# EAGLE design Voltage Regulator (EAGLE 7.6.0)
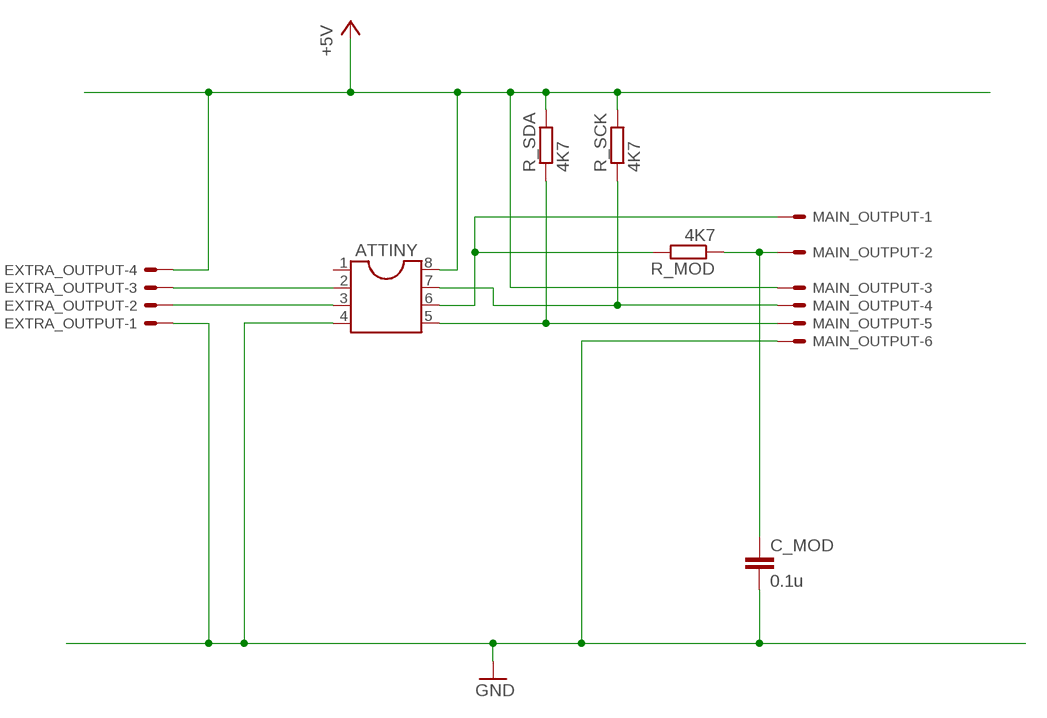
[diagram p0: schematic, sheet 1]

## Parts
ATTINY  DIL8  [DIL08]
C_MOD  0.1u  C-EUC1206  [C1206]
EXTRA_OUTPUT  KK-156-4  [KK-156-4]
MAIN_OUTPUT  KK-156-6  [KK-156-6]
R_MOD  4K7  R-EU_M0805  [M0805]
R_SCK  4K7  R-EU_M0805  [M0805]
R_SDA  4K7  R-EU_M0805  [M0805]

## Nets
+5V: ATTINY.8 EXTRA_OUTPUT.4 MAIN_OUTPUT.3 R_SCK.2 R_SDA.2
GND: ATTINY.4 C_MOD.2 EXTRA_OUTPUT.1 MAIN_OUTPUT.6
N$3: ATTINY.2 EXTRA_OUTPUT.3
N$5: ATTINY.3 EXTRA_OUTPUT.2
SCK: ATTINY.7 MAIN_OUTPUT.4 R_SCK.1
SDA: ATTINY.5 MAIN_OUTPUT.5 R_SDA.1
V_ANG: C_MOD.1 MAIN_OUTPUT.2 R_MOD.1
V_PWM: ATTINY.6 MAIN_OUTPUT.1 R_MOD.2
Unconnected: ATTINY.1

## Library data of the parts
ATTINY = ic-package:DIL8: Dual In Line / Socket
C_MOD = rcl:C-EU: CAPACITOR, European symbol
EXTRA_OUTPUT = con-molex:KK-156-4: KK 156 HEADER Source: http://www.molex.com/pdm_docs/sd/026604100_sd.pdf; OC_FARNELL: unknown; OC_NEWARK: unknown
MAIN_OUTPUT = con-molex:KK-156-6: KK 156 HEADER Source: http://www.molex.com/pdm_docs/sd/026604100_sd.pdf; OC_FARNELL: unknown; OC_NEWARK: unknown
R_MOD R_SCK R_SDA = rcl:R-EU_: RESISTOR, European symbol

## Board
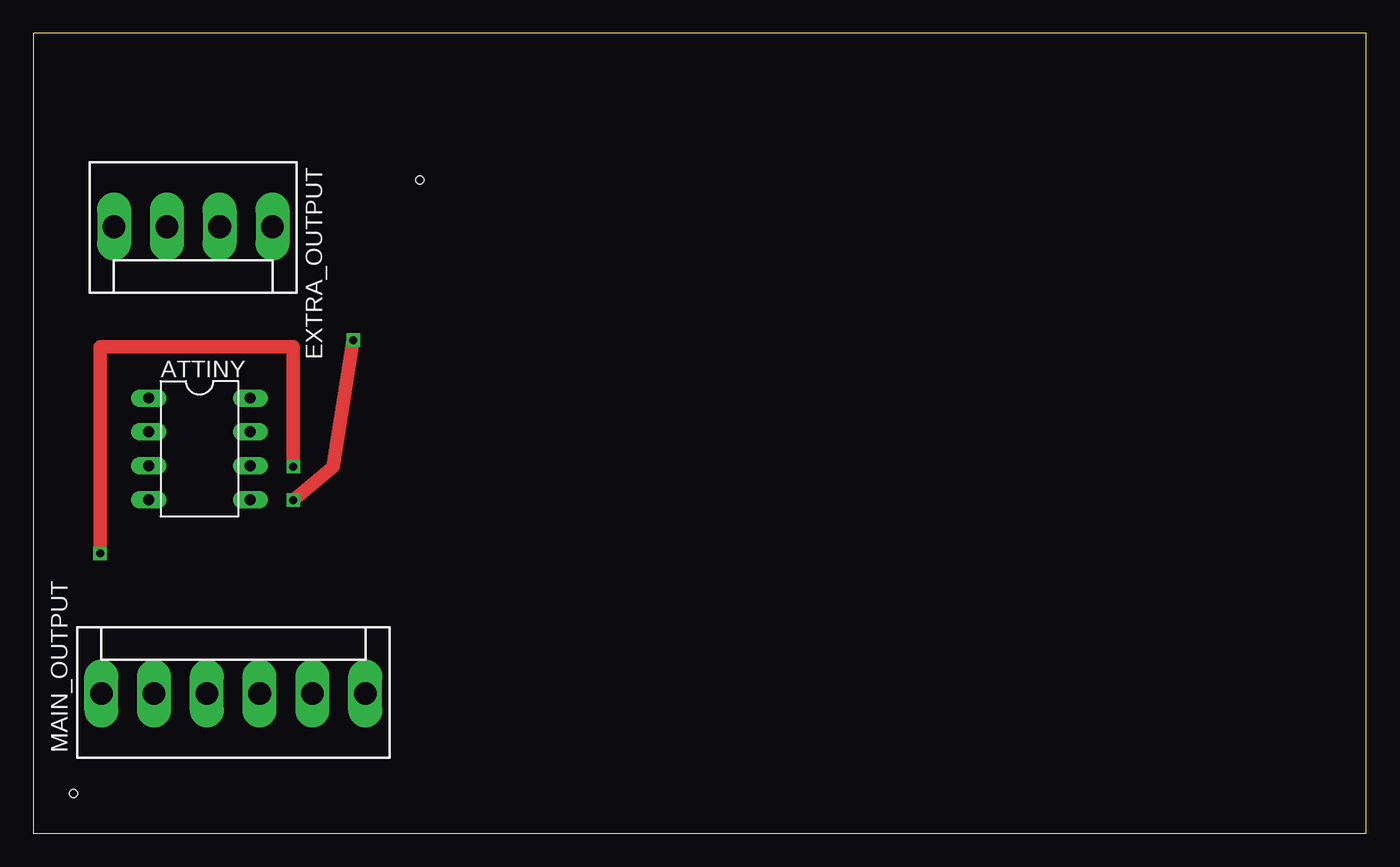
[diagram p1: board, top side]
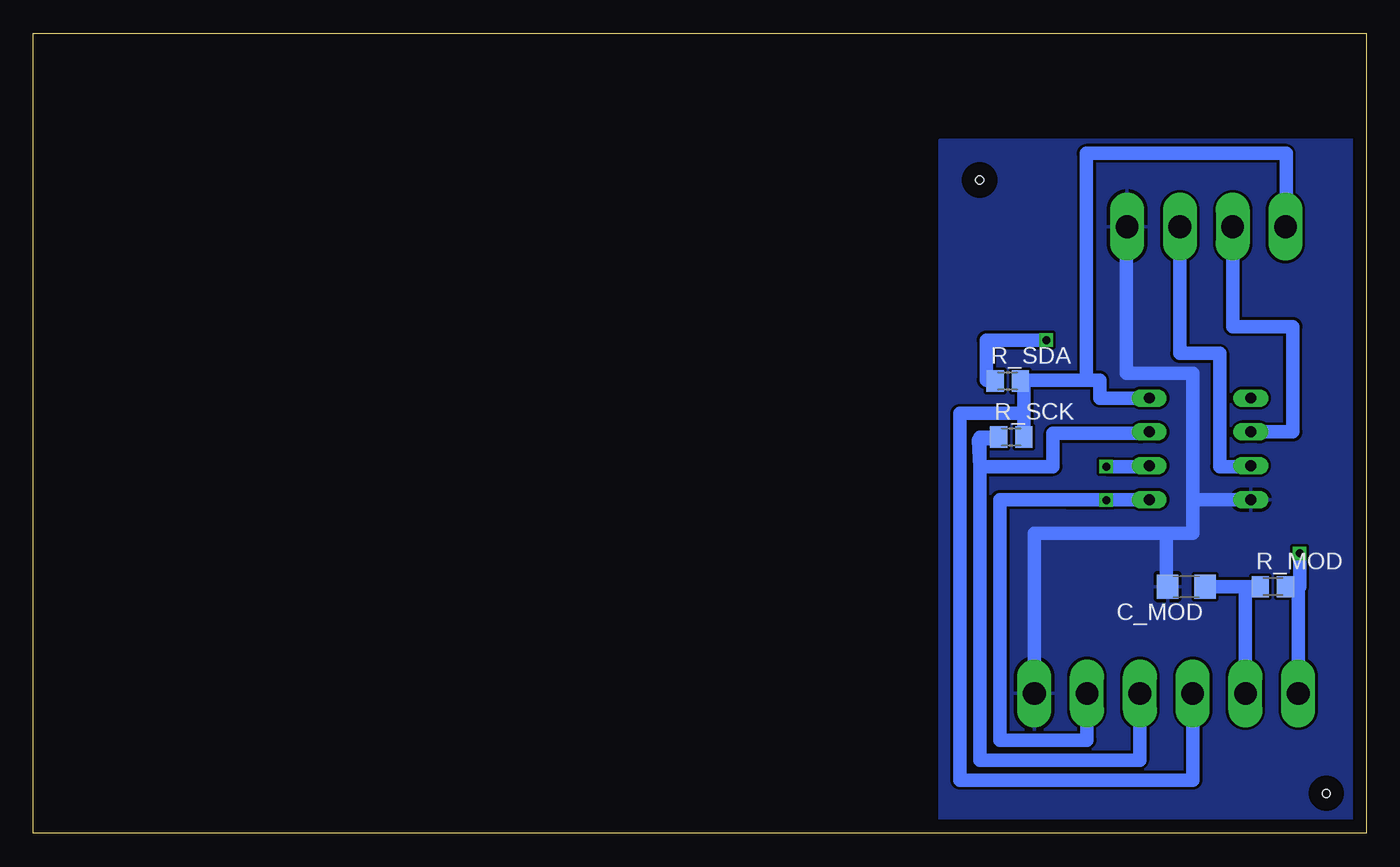
[diagram p2: board, bottom side, seen from below]

Size 100 x 60 mm. Coordinates in mm from the lower left corner, seen from the top.
Outline: 0,0 100,0 100,60 0,60 0,0
Copper layers (1*16): Top 0.035mm / dielectric 1.5mm / Bottom 0.035mm
Design rules "default *": minimum track width 10mil, minimum drill 24mil, track to track 8mil, track to pad 8mil, pad to pad 8mil, via to via 8mil, smd to smd 8mil, copper to edge 40mil, drill to drill 8mil, minimum pad ring 10mil, minimum via ring 8mil, stop-mask expansion 4mil, vias tented up to drill 0mil, thermal gap 10mil
Holes 0.6 mm at 3,3 29,49

### Footprints (pad centres in the part's own frame; a part is rotated, then mirrored left to right if it is on the bottom)
DIL08 = drill 0.813 long: 1 -3.81,-3.81; 2 -1.27,-3.81; 3 1.27,-3.81; 4 3.81,-3.81; 5 3.81,3.81; 6 1.27,3.81; 7 -1.27,3.81; 8 -3.81,3.81
C1206 = smd 1.6 x 1.8: 1 -1.4,0; 2 1.4,0
KK-156-4 = drill 1.7 pad 2.184 long: 1 -5.94,0; 2 -1.98,0; 3 1.98,0; 4 5.94,0
KK-156-6 = drill 1.7 pad 2.184 long: 1 -9.9,0; 2 -5.94,0; 3 -1.98,0; 4 1.98,0; 5 5.94,0; 6 9.9,0
M0805 = smd 1.3 x 1.6: 1 -0.95,0; 2 0.95,0

### Placement (x,y rotation side)
ATTINY  12.47,28.84 270 top
C_MOD  13.5,18.5 180 bottom
EXTRA_OUTPUT  12,45.5 180 top
MAIN_OUTPUT  15,10.5 0 top
R_MOD  7,18.5 0 bottom
R_SCK  26.63,29.72 0 bottom
R_SDA  26.9,33.92 0 bottom

### Tracks (layer width: path | path; a pad name or v marks a point on that pad's centre or on a via)
+5V
  Bottom 1.016: MAIN_OUTPUT.3 13,9 13,4 30.5,4 30.5,31.5 25.68,31.5 | ATTINY.8 20,32.65 20,34 21,34 | 21,34 25.45,34 R_SDA.2 25.68,33.92 25.68,31.5 | EXTRA_OUTPUT.4 6,45.5 6,51 21,51 21,34 | 25.68,31.5 R_SCK.2
GND
  Bottom 1.016: ATTINY.4 13,25.03 | 13,25.03 13,22.5 15,22.5 | 15,22.5 24.9,22.5 MAIN_OUTPUT.6 | EXTRA_OUTPUT.1 18,45.5 18,34.5 13,34.5 13,25.03 | C_MOD.2 15,18.5 15,22.5
  pour Bottom: 0,52 32,52 32,0 0,0
N$3
  Bottom 1.016: ATTINY.2 5.5,30.11 5.5,38 10.02,38 EXTRA_OUTPUT.3
N$5
  Bottom 1.016: EXTRA_OUTPUT.2 14,45.5 14,36 11,36 11,27.5 8.66,27.5 ATTINY.3
SCK
  Bottom 1.016: MAIN_OUTPUT.4 17,9 17,5.5 29,5.5 29,27.5 | 29,27.5 29.08,29.5 R_SCK.1 29,29.72 29,27.5 | ATTINY.7 16.28,30 23.5,30 23.5,27.5 29,27.5
SDA  (via drill 0.6)
  Top 1.016: v19.5,25 22.5,27.5 v24,37
  Bottom 1.016: MAIN_OUTPUT.5 20.94,7 27.5,7 27.5,25.03 ATTINY.5 22.5,25.03 v19.5,25 | v24,37 28.5,37 28.5,34 27.85,34 R_SDA.1
V_ANG
  Bottom 1.016: R_MOD.1 9.06,18.5 | 9.06,18.5 MAIN_OUTPUT.2 | 9.06,18.5 C_MOD.1
V_PWM  (via drill 0.6)
  Top 1.016: v19.5,27.5 19.5,36.5 5,36.5 v5,21
  Bottom 1.016: MAIN_OUTPUT.1 5.1,18.5 R_MOD.2 5,18.5 v5,21 | v19.5,27.5 16.28,27.5 ATTINY.6